# Altium schematic sheet SPI_Expander_MCP23S09.SchDoc
size A
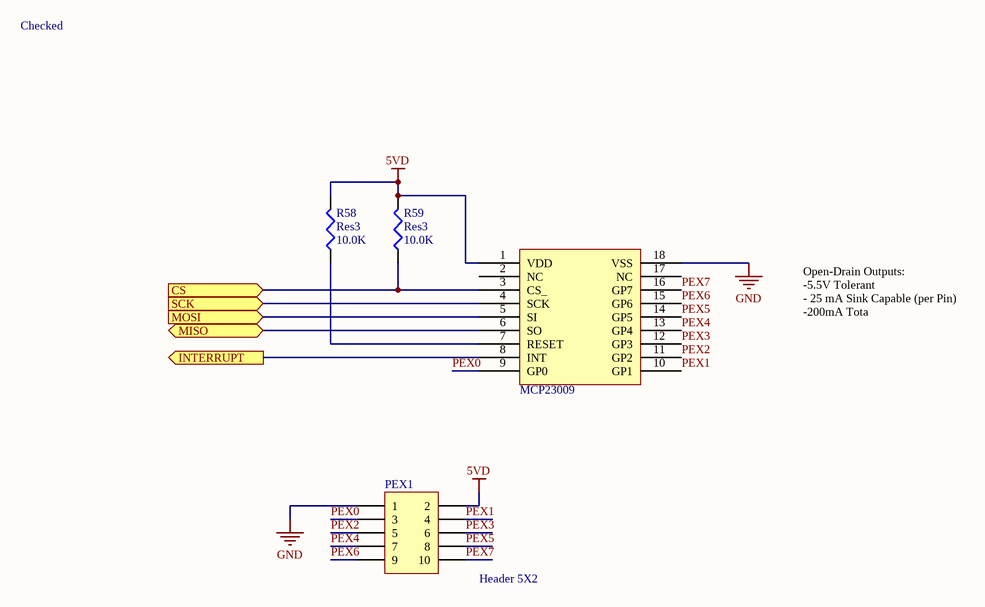
[diagram p0: SPI_Expander_MCP23S09.SchDoc]

## Parts
IC1  MCP23009  [MCP23009]
PEX1  Header 5X2  [HDR2X5]
R58  Res3  value 10.0K  [RESC2112X05M]
R59  Res3  value 10.0K  [RESC2112X05M]

## Ports
CS (in), INTERRUPT (out), MISO, MOSI (in), SCK (in)

## Nets
5VD: IC1.1(VDD) PEX1.2 R58.2 R59.2
GND: IC1.18(VSS) PEX1.1
CS: IC1.3(CS_) R59.1 ; port CS
INTERRUPT: IC1.8(INT) ; port INTERRUPT
MISO: IC1.6(SO) ; port MISO
MOSI: IC1.5(SI) ; port MOSI
PEX0: IC1.9(GP0) PEX1.3
PEX1: IC1.10(GP1) PEX1.4
PEX2: IC1.11(GP2) PEX1.5
PEX3: IC1.12(GP3) PEX1.6
PEX4: IC1.13(GP4) PEX1.7
PEX5: IC1.14(GP5) PEX1.8
PEX6: IC1.15(GP6) PEX1.9
PEX7: IC1.16(GP7) PEX1.10
SCK: IC1.4(SCK) ; port SCK
NetIC1_7: IC1.7(RESET) R58.1

Not connected (* = marked no-connect by the designer): IC1 2(NC) 17(NC)

## Notes on the sheet
- Checked
- Open-Drain Outputs:
  -5.5V Tolerant
  - 25 mA Sink Capable (per Pin)
  -200mA Tota

## Library data of the parts
PEX1 = Header 5X2: Header, 5-Pin, Dual row; LatestRevisionDate: 17-Jul-2002; LatestRevisionNote: Re-released for DXP Platform.; Publisher: Altium Limited
R58 R59 = Resistor_10.0K: RES SMD 10.0K OHM 1% 1/8W 0805; MPN: CRCW080510K0FKEA; PN: 541-10.0KCCT-ND; Name: Resistor_10.0K; URL: http://www.digikey.ca/product-detail/en/CRCW080510K0FKEA/541-10.0KCCT-ND
IC1 = MCP23009: URL: http://www.digikey.ca/product-detail/en/MCP23S09-E%2FSO/MCP23S09-E%2FSO-ND/2021356; DATASHEET: http://www.microchip.com/mymicrochip/filehandler.aspx?ddocname=en538928